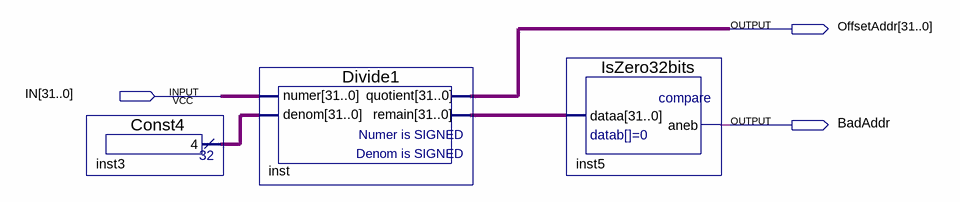
[diagram p0: schematic sheet]
// Quartus schematic OffsetAddressCalc.bdf as structural Verilog: 3 symbols, 3 pins
module OffsetAddressCalc (
  input  [31:0] IN,
  output [31:0] OffsetAddr,
  output BadAddr
);

  wire [31:0] inst3_result, inst_remain;

  Const4 inst3 (.result(inst3_result));
  Divide1 inst (.numer(IN), .denom(inst3_result), .quotient(OffsetAddr), .remain(inst_remain));
  IsZero32bits inst5 (.dataa(inst_remain), .aneb(BadAddr));
endmodule
